# Altium project ChanginMelodies_RPIShield.PrjPcb
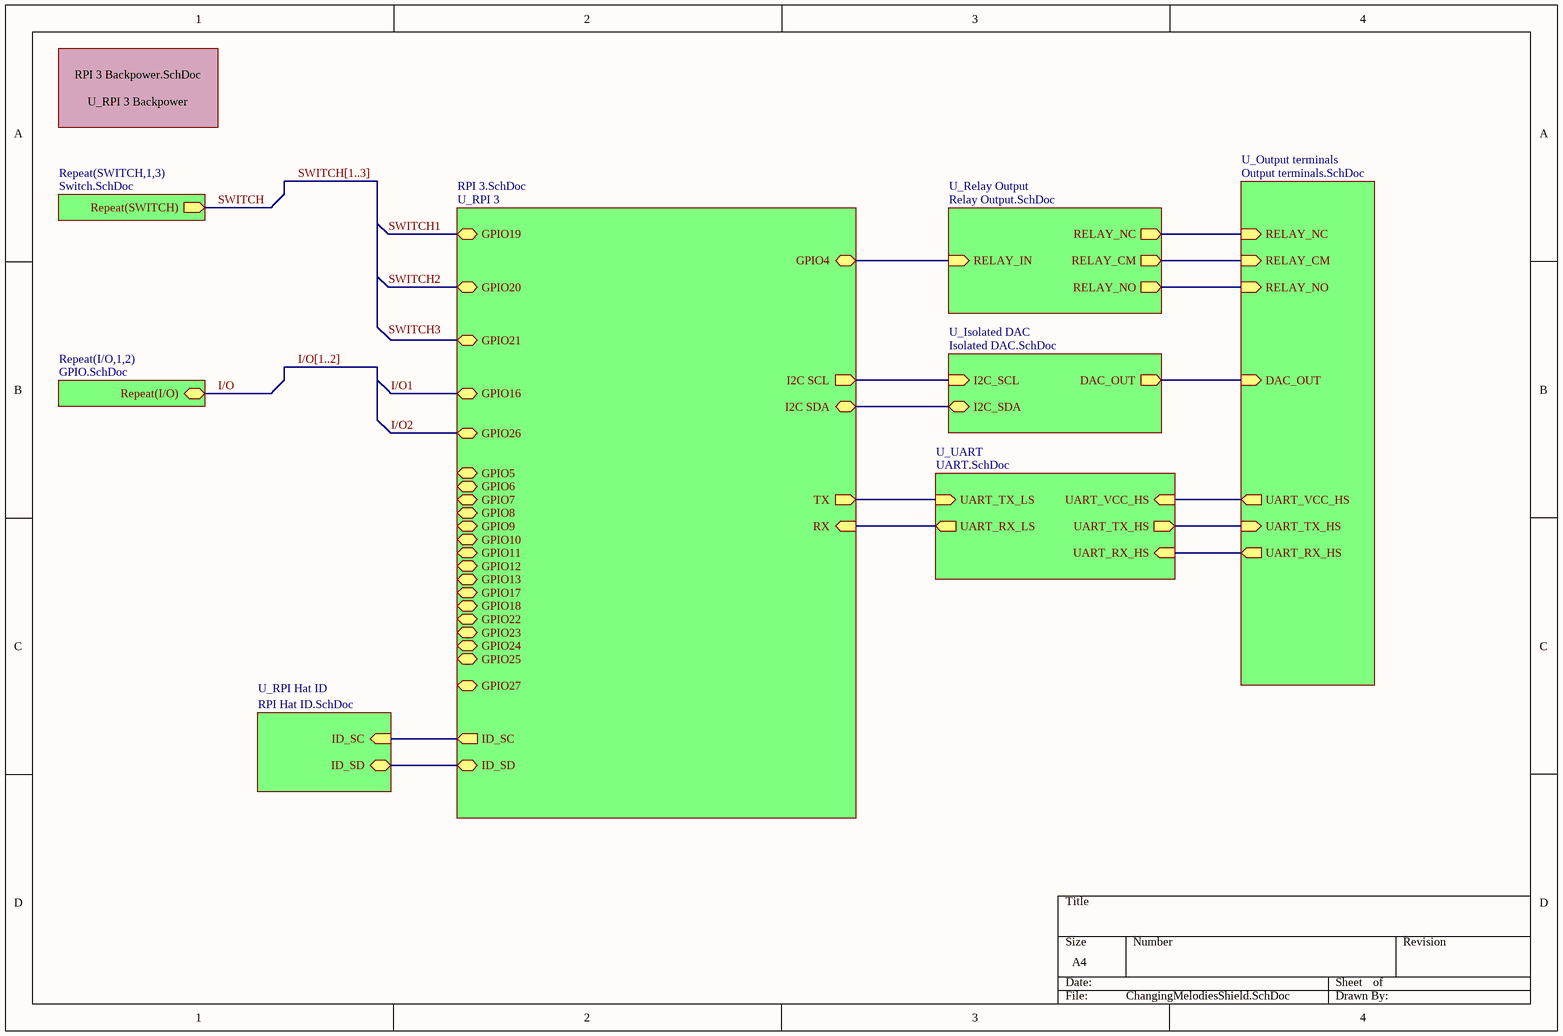
[diagram p0: ChangingMelodiesShield.SchDoc]
9 sheets, 52 parts. Net scope: hierarchical (ports join the sheet entries above them; power ports are global).
Board file: ChangingMelodiesShield.PcbDoc
Sheets:
  ChangingMelodiesShield.SchDoc
    U_RPI 3 = RPI 3.SchDoc
    U_RPI 3 Backpower = RPI 3 Backpower.SchDoc
    U_RPI Hat ID = RPI Hat ID.SchDoc
    U_Output terminals = Output terminals.SchDoc
    U_Relay Output = Relay Output.SchDoc
    U_UART = UART.SchDoc
    SWITCH1 = Switch.SchDoc
    SWITCH2 = Switch.SchDoc
    SWITCH3 = Switch.SchDoc
    I/O1 = GPIO.SchDoc
    I/O2 = GPIO.SchDoc

## Sheet ChangingMelodiesShield.SchDoc
size A4

### Sub-sheets
Repeat(I/O,1,2) = GPIO.SchDoc: Repeat(I/O) (bidir)
Repeat(SWITCH,1,3) = Switch.SchDoc: Repeat(SWITCH) (out)
U_Isolated DAC = Isolated DAC.SchDoc (file not in this document): I2C_SCL (in), I2C_SDA (bidir), DAC_OUT (out)
U_Output terminals = Output terminals.SchDoc: DAC_OUT (in), RELAY_NO (in), RELAY_NC (in), RELAY_CM (in), UART_RX_HS (out), UART_VCC_HS (out), UART_TX_HS (in)
U_Relay Output = Relay Output.SchDoc: RELAY_IN (in), RELAY_NC (out), RELAY_NO (out), RELAY_CM (out)
U_RPI 3 = RPI 3.SchDoc: I2C SDA (bidir), I2C SCL (out), GPIO4 (bidir), GPIO17 (bidir), GPIO27 (bidir), GPIO22 (bidir), GPIO26 (bidir), GPIO19 (bidir), GPIO6 (bidir), GPIO5 (bidir), RX (in), TX (out), GPIO24 (bidir), GPIO25 (bidir), GPIO12 (bidir), GPIO18 (bidir), GPIO23 (bidir), ID_SD (bidir), GPIO13 (bidir), GPIO16 (bidir), GPIO8 (bidir), ID_SC (out), GPIO21 (bidir), GPIO7 (bidir), GPIO20 (bidir), GPIO11 (bidir), GPIO9 (bidir), GPIO10 (bidir)
U_RPI 3 Backpower = RPI 3 Backpower.SchDoc: no entries
U_RPI Hat ID = RPI Hat ID.SchDoc: ID_SD (bidir), ID_SC (in)
U_UART = UART.SchDoc: UART_RX_LS (out), UART_TX_LS (in), UART_RX_HS (in), UART_TX_HS (out), UART_VCC_HS (in)

### Nets
GPIO4: sheet U_RPI 3/GPIO4, sheet U_Relay Output/RELAY_IN
I2C SCL: sheet U_RPI 3/I2C SCL, sheet U_Isolated DAC/I2C_SCL
I2C SDA: sheet U_RPI 3/I2C SDA, sheet U_Isolated DAC/I2C_SDA
I/O: sheet Repeat(I/O,1,2)/Repeat(I/O)
ID_SC: sheet U_RPI 3/ID_SC, sheet U_RPI Hat ID/ID_SC
ID_SD: sheet U_RPI 3/ID_SD, sheet U_RPI Hat ID/ID_SD
RELAY_CM: sheet U_Output terminals/RELAY_CM, sheet U_Relay Output/RELAY_CM
RELAY_NC: sheet U_Output terminals/RELAY_NC, sheet U_Relay Output/RELAY_NC
RELAY_NO: sheet U_Output terminals/RELAY_NO, sheet U_Relay Output/RELAY_NO
RX: sheet U_RPI 3/RX, sheet U_UART/UART_RX_LS
SWITCH: sheet Repeat(SWITCH,1,3)/Repeat(SWITCH)
TX: sheet U_RPI 3/TX, sheet U_UART/UART_TX_LS
UART_RX_HS: sheet U_Output terminals/UART_RX_HS, sheet U_UART/UART_RX_HS
UART_TX_HS: sheet U_Output terminals/UART_TX_HS, sheet U_UART/UART_TX_HS
UART_VCC_HS: sheet U_Output terminals/UART_VCC_HS, sheet U_UART/UART_VCC_HS
NetSWITCH_1: sheet U_Isolated DAC/DAC_OUT, sheet U_Output terminals/DAC_OUT

### Buses and harness runs
bus I/O[1..2]
bus SWITCH[1..3]

## Sheet RPI 3.SchDoc
size A4; SheetNumber: 1; SheetTotal: 1
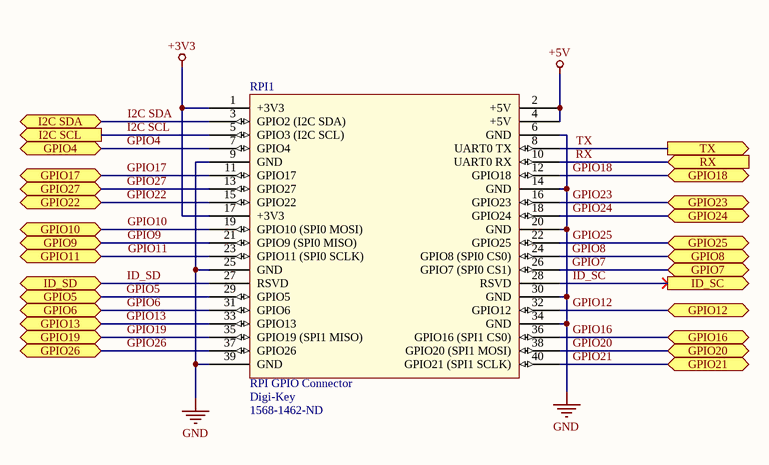
[diagram p1: RPI 3.SchDoc]

### Parts
RPI1  RPI GPIO Connector  Supplier 1: Digi-Key  Supplier Part Number 1: 1568-1462-ND  [rpi]

### Ports
GPIO4 (bidir), GPIO5 (bidir), GPIO6 (bidir), GPIO7 (bidir), GPIO8 (bidir), GPIO9 (bidir), GPIO10 (bidir), GPIO11 (bidir), GPIO12 (bidir), GPIO13 (bidir), GPIO16 (bidir), GPIO17 (bidir), GPIO18 (bidir), GPIO19 (bidir), GPIO20 (bidir), GPIO21 (bidir), GPIO22 (bidir), GPIO23 (bidir), GPIO24 (bidir), GPIO25 (bidir), GPIO26 (bidir), GPIO27 (bidir), I2C SCL (out), I2C SDA (bidir), ID_SC (out), ID_SD (bidir), RX (in), TX (out)

### Nets
+3V3: RPI1.1(+3V3) RPI1.17(+3V3)
+5V: RPI1.2(+5V) RPI1.4(+5V)
GND: RPI1.6(GND) RPI1.9(GND) RPI1.14(GND) RPI1.20(GND) RPI1.25(GND) RPI1.30(GND) RPI1.34(GND) RPI1.39(GND)
GPIO4: RPI1.7(GPIO4) ; port GPIO4
GPIO5: RPI1.29(GPIO5) ; port GPIO5
GPIO6: RPI1.31(GPIO6) ; port GPIO6
GPIO7: RPI1.26(GPIO7_(SPI0_CS1)) ; port GPIO7
GPIO8: RPI1.24(GPIO8_(SPI0_CS0)) ; port GPIO8
GPIO9: RPI1.21(GPIO9_(SPI0_MISO)) ; port GPIO9
GPIO10: RPI1.19(GPIO10_(SPI0_MOSI)) ; port GPIO10
GPIO11: RPI1.23(GPIO11_(SPI0_SCLK)) ; port GPIO11
GPIO12: RPI1.32(GPIO12) ; port GPIO12
GPIO13: RPI1.33(GPIO13) ; port GPIO13
GPIO16: RPI1.36(GPIO16_(SPI1_CS0)) ; port GPIO16
GPIO17: RPI1.11(GPIO17) ; port GPIO17
GPIO18: RPI1.12(GPIO18) ; port GPIO18
GPIO19: RPI1.35(GPIO19_(SPI1_MISO)) ; port GPIO19
GPIO20: RPI1.38(GPIO20_(SPI1_MOSI)) ; port GPIO20
GPIO21: RPI1.40(GPIO21_(SPI1_SCLK)) ; port GPIO21
GPIO22: RPI1.15(GPIO22) ; port GPIO22
GPIO23: RPI1.16(GPIO23) ; port GPIO23
GPIO24: RPI1.18(GPIO24) ; port GPIO24
GPIO25: RPI1.22(GPIO25) ; port GPIO25
GPIO26: RPI1.37(GPIO26) ; port GPIO26
GPIO27: RPI1.13(GPIO27) ; port GPIO27
I2C SCL: RPI1.5(GPIO3_(I2C_SCL)) ; port I2C SCL
I2C SDA: RPI1.3(GPIO2_(I2C_SDA)) ; port I2C SDA
ID_SC: RPI1.28(RSVD) ; port ID_SC
ID_SD: RPI1.27(RSVD) ; port ID_SD
RX: RPI1.10(UART0_RX) ; port RX
TX: RPI1.8(UART0_TX) ; port TX

### Library data of the parts
RPI1 = rpi connector: GPIO Header for Raspberry Pi A+/B+/Pi 2/Pi 3 - 2x20; Manufacturer: SparkFun Electronics; Manufacturer Part Number: PRT-14017; Nils Minor: author; nilsminor@web.de: mail; RoHS: RoHS Compliant; Category: Development Boards, Kits, Programmers; Stock 1: 150; Pricing 1: 1=1.84 (EUR); Part Status: Active; Accessory Type: Connector; For Use With/Related Products: Raspberry Pi; ComponentLink1URL: https://cdn.sparkfun.com/datasheets/Dev/RaspberryPi/12313.pdf; ComponentLink1Description: https://cdn.sparkfun.com/datasheets/Dev/RaspberryPi/12313.pdf

## Sheet RPI 3 Backpower.SchDoc
size A4
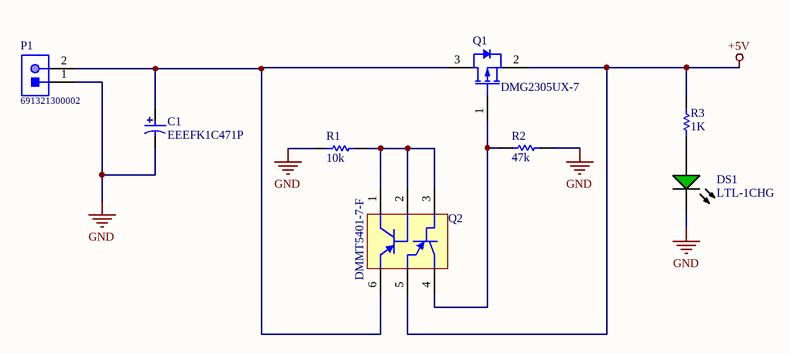
[diagram p2: RPI 3 Backpower.SchDoc]

### Parts
C1  EEEFK1C471P  [PNSC-FK-V-F_V]
DS1  LTL-1CHG  [LTST-LTL-1CHG-2]
P1  691321300002  [691321300002]
Q1  DMG2305UX-7  [DIOD-SOT23-3_A_V]
Q2  DMMT5401-7-F  [DIOD-SOT-26-6_N]
R1  10k  [RESC1609X55X30LL15T15]
R2  47k  [RESC1608X55X25LL10T15]
R3  1K  [RESC1608X55X30LL15T15]

### Nets
+5V: Q1.2(SOURCE) Q2.5(E2) R3.2
GND: C1.2 DS1.2(K) P1.1 R1.1 R2.1
NetC1_1: C1.1 P1.2 Q1.3(DRAIN) Q2.6(E1)
NetDS1_1: DS1.1(A) R3.1
NetQ1_1: Q1.1(GATE) Q2.4(C2) R2.2
NetQ2_1: Q2.1(C1) Q2.2(B1) Q2.3(B2) R1.2

### Library data of the parts
C1 = CMP-2000-06204-1: Aluminum Electrolytic Capacitor, 470 uF, +/- 20%, 16 V, 2-Pin SMD (Size Code F), -55 to 105 degC, RoHS, Tape and Reel; Manufacturer: Panasonic; Capacitance: 470µF; Type: Can; Ripple Current: 600mA; Lifetime@Temperature: 2000Hrs@105°C; Impedance: 0.16O; Rated Voltage: 16V; Manufacturer URL: http://www.panasonic.com/; Package Description: 2-Pin Electrolytic Aluminum Capacitor, Body 8.3 x 8.3 mm; Operating Temp-Max: 105°C; Mounting Technology: SurfaceMount; Operating Temp Range: -55to+105°C; Datasheet Version: 03/2016; Series: FK; Package Reference: FK-V-F; Case Size/Dimension: Ø8x10.2mm; Package URL: http://industrial.panasonic.com/cdbs/www-data/pdf/RDE0000/DME0000COL48.pdf; Datasheet URL: http://industrial.panasonic.com/cdbs/www-data/pdf/RDE0000/ABA0000C1181.pdf
DS1 = CMP-1674-00014-1: LITE-ON Electronic, INC, 120 mA, 100 mW, 5 V, -55 to 100 degC, 2-Pin THD, RoHS, Bulk; Case\Package: QFN; Max Supply Voltage: 3.6 V; Interface: I2C; Min Supply Voltage: 2.5 V; ComponentLink1URL: http://www.us.liteon.com/; DatasheetVersion: Mar-00; Max Operating Temperature: 85 degC; ComponentLink2URL: http://datasheet.octopart.com/LTL-1CHG-Lite-On-datasheet-143841.pdf; Min Operating Temperature: -40 degC; PackageReference: LTL-1CHG; RoHSCompliant: true; Pins: 24; PackageDescription: 2-Pin Through Hole Device, Dia 3.8 mm; ComponentLink1Description: Manufacturer URL; Packaging: Cut Tape; ComponentLink2Description: Datasheet; Package Quantity: 5000; REACH SVHC: No SVHC
P1 = CMP-1502-01863-1: Serie 321 - 3.81mm Vertical PCB Header WR-TBL, 2 pin; Manufacturer: Wurth Elektronik; Gender: Male; Pin Number: 2; Part Number: 691321300002; Mounting Technology: THT; Manufacturer URL: http://www.we-online.de; Datasheet URL: http://katalog.we-online.de/em/datasheet/6913213000xx.pdf; Packaging: Box; Package Reference: 691321300002; Publisher: WurthElektronik; Pitch: 3.81mm; Operating Temperature: -40to105degC
Q1 = CMP-1693-00002-3: P-Channel Enhancement Mode MOSFET, 20 V, -55 to 150 degC, 3-Pin SOT23, RoHS, Tape and Reel; RoHSCompliant: True; Pins: 3; PackageDescription: 3-Pin Small Outline Transistor, Body 2.9 x 1.3 mm, Pitch 0.915 mm; Min Operating Temperature: -55 degC; Mounting Technology: Surface Mount; ComponentLink2URL: http://www.diodes.com/_files/datasheets/DMG2305UX.pdf; PartNumber: DMG2305UX-7; ComponentLink1URL: http://www.diodes.com/; DatasheetVersion: Rev. 5-2; Max Operating Temperature: 150 degC; Packaging: Tape and Reel; Radiation Hardening: No; ComponentLink1Description: Manufacturer URL; Case/Package: TO-236-3; ComponentLink2Description: Datasheet; Package Quantity: 1; Mount: Surface Mount
Q2 = CMP-1667-00007-1: Matched PNP Small Signal Surface Mount Transistor, 300 mW, -55 to 150 degC, 6-Pin SOT-26, RoHS, Tape and Reel; Tolerance: 1%; Resistance: 56.2 kohm; Case\Package: 0603; Voltage Rating: 50 V; Power Rating: 100 mW; Width: 0.8 mm; ComponentLink2URL: http://www.diodes.com/_files/datasheets/ds30437.pdf; ComponentLink2Description: Datasheet; Min Operating Temperature: -55 degC; Max Operating Temperature: 155 degC; Height: 0.45 mm; Case Code (Metric): 1608; Package Quantity: 200; DatasheetVersion: Rev. 6-2, 05/2009; Packaging: Tape and Reel; Length: 1.6 mm; PackageDescription: 6-Pin Small Outline Transistor, Body 1.6 x 3 mm, Pitch 0.95 mm; RoHSCompliant: true; PackageReference: SOT-26-6; ComponentLink1URL: http://www.diodes.com/; Case Code (Imperial): 0603; ComponentLink1Description: Manufacturer URL
R1 = CMP-2000-07452-1: Chip Resistor, 10 KOhm, +/- 1%, 0.1 W, -55 to 155 degC, 0603 (1608 Metric), RoHS, Tape and Reel; Manufacturer: Panasonic; Voltage Rating: 75V; Case\/Package: 0603; Power Rating: 100mW; Resistance: 10KOhm; Temperature Coefficient: 100ppm\/degreesC; Number of Pins: 2; Package Reference: 603; Depth: 0.8mm; Mount: SurfaceMount; Package Description: 2-Pin Surface Mount Device, Body 1.6 x 0.85 mm; Datasheet Version: 02/2017; Length: 1.6mm; Lead Free: LeadFree; Height: 0.45mm; Number of Terminations: 2; Max Power Dissipation: 100mW; Min Operating Temperature: -55degC; Datasheet URL: https://industrial.panasonic.com/cdbs/www-data/pdf/RDA0000/AOA0000C304.pdf; Termination: SMD/SMT; Case Code (Metric): 1608; Case Code (Imperial): 0603; Tolerance: 1%; Max Operating Temperature: 155degC; RoHSCompliant: true; Voltage Rating (DC): 75V; Radiation Hardening: No; Packaging: TapeandReel; Composition: ThickFilm; Mounting Technology: SurfaceMount; Manufacturer URL: http://www.panasonic.com/; Width: 0.031inch; REACH SVHC: NoSVHC; Contact Plating: Tin; Military Standard: Not; Package Quantity: 1
R2 = CMP-2000-04844-1: Manufacturer: Yageo; Part Number: AC0603FR-0747KL
R3 = CMP-2000-00180-1: Part Number: ERJ-3EKF1001V; Manufacturer: Panasonic

## Sheet RPI Hat ID.SchDoc
size A4
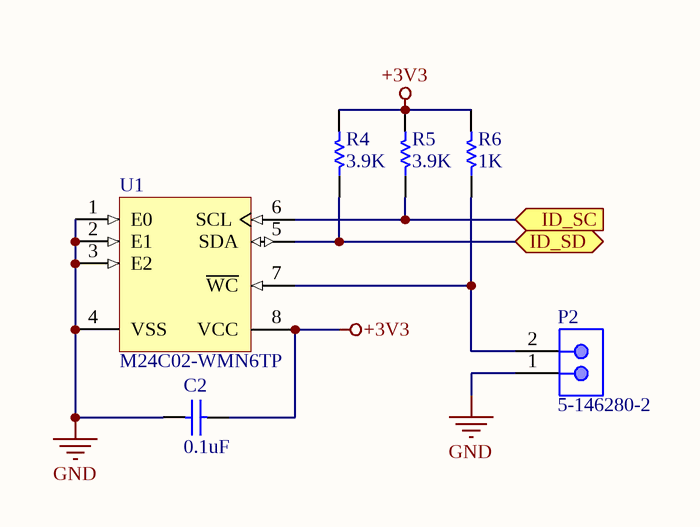
[diagram p3: RPI Hat ID.SchDoc]

### Parts
C2  0.1uF  [CAPC1608X87X35NL15T15]
P2  5-146280-2  [TECO-5-146280-2_V]
R4  3.9K  [RESC1608X55X30ML15T15]
R5  3.9K  [RESC1608X55X30ML15T15]
R6  1K  [RESC1608X55X30ML15T15]
U1  M24C02-WMN6TP  [STM-M24C02-WMN6TP-8_M]

### Ports
ID_SC (in), ID_SD (bidir)

### Nets
+3V3: C2.1 R4.2 R5.2 R6.2 U1.8(VCC)
GND: C2.2 P2.1 U1.1(E0) U1.2(E1) U1.3(E2) U1.4(VSS)
ID_SC: R5.1 U1.6(SCL) ; port ID_SC
ID_SD: R4.1 U1.5(SDA) ; port ID_SD
NetP2_2: P2.2 R6.1 U1.7(~{WC})

### Library data of the parts
C2 = CMP-2006-03300-1: Part Number: C0603X104K5RACTU; Manufacturer: Kemet
P2 = CMP-2000-07492-1: Male Header, Pitch 2.54 mm, 1 x 2 Position, Height 8.21 mm, Tail Length 3.05 mm, -65 to 105 degC, RoHS, Bulk; Manufacturer: TE Connectivity; Mating Connector Lock: No(Without); Number of Positions: 2; Pitch: 2.54mm; PCB Mounting Orientation: Vertical; Keyed: No; Case\/Package: 100; Mating Post Length: 0.23inch; High Temperature Housing: Yes; Max Current Rating: 5A; PCB Thickness: 0.063inch; PCB Mount Retention: Without; Approvals: CSA; Current Rating: 3A; Radiation Hardening: No; Length: 4.67mm; Contact Mating Length: 0.23inch; Connector Type: Header; Number of Rows: 1; Termination Post Length: 0.12inch; Board Standoff: No(Without); Max Operating Temperature: 105degC; Contact Shape: Square; Selectively Loaded: No(Without); Gasket: No(Without); Number of Contacts: 2; Contact Gender: Male; Mating Alignment: No(Without); Manufacturer URL: http://www.te.com/; Datasheet URL: http://www.te.com/commerce/DocumentDelivery/DDEController?Action=showdoc&DocId=Customer+Drawing%7F146280%7FH1%7Fpdf%7FEnglish%7FENG_CD_146280_H1.pdf%7F5-146280-2; Mount: ThroughHole; Orientation: Straight; Packaging: Carton; Package Reference: 5-146280-2; Package Quantity: 500; Stabilizers: No(Without); Row Spacing: 2.54mm; Contact Material: CopperAlloy; Panel Mount Retention: No(Without); Datasheet Version: Rev. H1, 08/2016; Housing Colour: Black; Colour: Black; Package Description: Male Header, Pitch 2.54 mm, 1 x 2 Position, Height 8.21 mm, Tail Length 3.05 mm; Contact Plating: Matte; Housing Material: Polymer; Contact Protection: No(Without); Min Operating Temperature: -65degC; Mounting Technology: ThroughHole; Flammability Rating: UL94V-0; RoHSCompliant: true; Termination: ThroughHole; Depth: 2.34mm; High Speed Serial Data Connector: No
R4-R6 = CMP-2000-00180-1: as R3 on sheet RPI 3 Backpower
U1 = CMP-2000-05370-1: EEPROM Serial-I2C, 2Kbit, 2.5 to 5.5 V, 400 kHz, 8-Pin SO, -40 to 85 degC, RoHS, Tape and Reel; Manufacturer: STMicroelectronics; Supply Current: 2mA; Frequency: 0.4MHz; Data Retention: 40; Density: 2048Bit; Rad Hardened: No; Write Protection: Yes; Interface Type: Serial(I2C); DELETED: Compliant; Access Time (Max): 900ns; Operating Supply Voltage (Typ): 3.3/5V; Operating Supply Voltage (Max): 5.5V; Organization: 256x8; Operating Supply Voltage (Min): 2.5V; Operating Temperature (Max): 85C; Operating Temperature Classification: Industrial; Operating Temp Range: -40Cto85C; Frequency (Max): 0.4MHz; Datasheet URL: https://datasheet.ciiva.com/26870/m24c02-wmn6tp-26870257.pdf; Package Type: SOICN; Operating Temperature (Min): -40C; Programmable: Yes; Manufacturer URL: http://www.st.com/; Pin Count: 8; Packaging: TapeandReel; Mounting: SurfaceMount; Datasheet Version: Rev. 17, 04/2011

## Sheet Output terminals.SchDoc
size A4
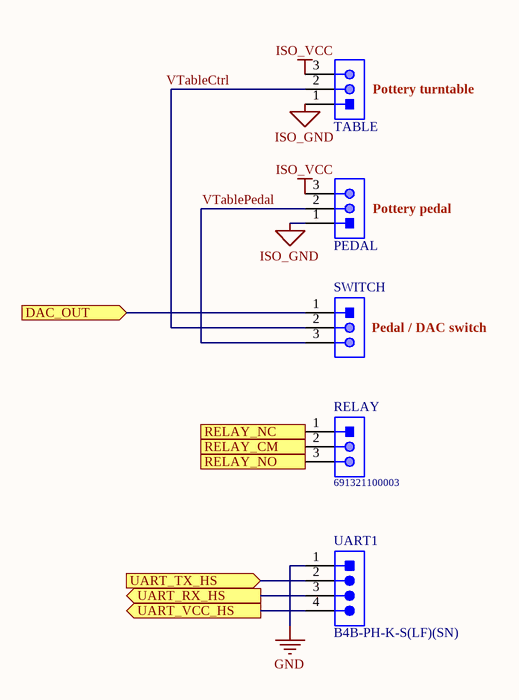
[diagram p4: Output terminals.SchDoc]

### Parts
PEDAL  691321300003  [691321300003]  (value not drawn)
RELAY  691321100003  [691321100003]
SWITCH  691321300003  [691321300003]  (value not drawn)
TABLE  691321300003  [691321300003]  (value not drawn)
UART1  B4B-PH-K-S(LF)(SN)  [JST-B4B-PH-K-S_V]

### Ports
DAC_OUT (in), RELAY_CM (in), RELAY_NC (in), RELAY_NO (in), UART_RX_HS (out), UART_TX_HS (in), UART_VCC_HS (out)

### Nets
GND: UART1.1
ISO_GND: PEDAL.1 TABLE.1
ISO_VCC: PEDAL.3 TABLE.3
RELAY_CM: RELAY.2 ; port RELAY_CM
RELAY_NC: RELAY.1 ; port RELAY_NC
RELAY_NO: RELAY.3 ; port RELAY_NO
UART_RX_HS: UART1.3 ; port UART_RX_HS
UART_TX_HS: UART1.2 ; port UART_TX_HS
UART_VCC_HS: UART1.4 ; port UART_VCC_HS
VTableCtrl: SWITCH.2 TABLE.2
VTablePedal: PEDAL.2 SWITCH.3
NetSWITCH_1: SWITCH.1 ; port DAC_OUT

### Notes on the sheet
- (near TABLE) Pottery turntable
- (near PEDAL) Pottery pedal
- (near SWITCH) Pedal / DAC switch

### Library data of the parts
PEDAL SWITCH TABLE = CMP-1502-01864-1: Serie 321 - 3.81mm Vertical PCB Header WR-TBL, 3 pin; Manufacturer: Wurth Elektronik; Pin Number: 3; Gender: Male; Datasheet URL: http://katalog.we-online.de/em/datasheet/6913213000xx.pdf; Package Reference: 691321300003; Pitch: 3.81mm; Publisher: WurthElektronik; Part Number: 691321300003; Mounting Technology: THT; Packaging: Box; Manufacturer URL: http://www.we-online.de; Operating Temperature: -40to105degC
RELAY = CMP-1502-01784-1: Serie 3211 - 3.50mm Vertical PCB Header WR-TBL, 3 pin; Manufacturer: Wurth Elektronik; Pin Number: 3; Gender: Male; Datasheet URL: http://katalog.we-online.de/em/datasheet/6913211000xx.pdf; Package Reference: 691321100003; Pitch: 3.50mm; Publisher: WurthElektronik; Part Number: 691321100003; Mounting Technology: THT; Packaging: Box; Manufacturer URL: http://www.we-online.de; Operating Temperature: -40to105degC
UART1 = CMP-2000-05165-1: Male Header, Pitch 2 mm, 1 x 4 Position, Height 6 mm, Tail Length 3.4 mm, -25 to 85 degC, RoHS, Bulk; Manufacturer: JST; No of Positions: 4; Style/Orientation: StraightHeader/Plug; Pitch: 2mm; Datasheet URL: http://datasheet.octopart.com/B4B-PH-K-S%28LF%29%28SN%29-JST-datasheet-10558886.pdf; Type: ShroudedHeader; Manufacturer URL: http://www.jst.com/home2.html; Termination: Crimp; Datasheet Version: Apr-09

## Sheet Relay Output.SchDoc
size A4
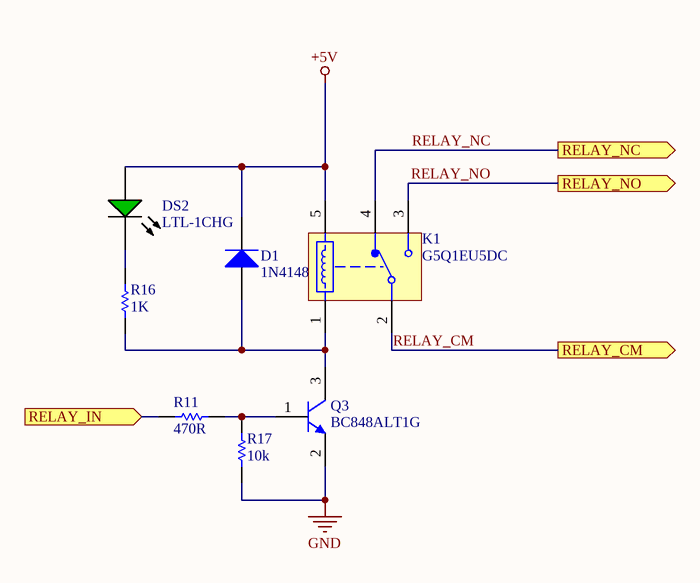
[diagram p5: Relay Output.SchDoc]

### Parts
D1  1N4148WT  [FAIR-SOD-523F-2_V]
DS2  LTL-1CHG  [LTST-LTL-1CHG-2]
K1  G5Q1EU5DC  [G5Q1EU5DC]
Q3  BC848ALT1G  [ONSC-SOT-23-3-318-08_V]
R11  470R  [RESC0603(1608)_M]
R16  1K  [RESC1608X55X30LL15T15]
R17  10k  [RESC1609X55X30LL15T15]

### Ports
RELAY_CM (out), RELAY_IN (in), RELAY_NC (out), RELAY_NO (out)

### Nets
+5V: D1.1(K) DS2.1(A) K1.5
GND: Q3.2(E) R17.1
GPIO4: R11.1 ; port RELAY_IN
RELAY_CM: K1.2 ; port RELAY_CM
RELAY_NC: K1.4 ; port RELAY_NC
RELAY_NO: K1.3 ; port RELAY_NO
NetD1_2: D1.2(A) K1.1 Q3.3(C) R16.1
NetDS2_2: DS2.2(K) R16.2
NetQ3_1: Q3.1(B) R11.2 R17.2

### Library data of the parts
D1 = CMP-0881-00001-1: High Conductance Fast Switching Diode, 75 V, -55 to 150 degC, 2-Pin SOD523F, RoHS; Manufacturer: Fairchild Semiconductor; IR (VR: 75 V)=5 uA Max.; VF: 1 V Max.; BVR (IR: 5 uA)=75 V Min.; CO: 4 pF Max.; DatasheetVersion: Rev. A2; ComponentLink1Description: Manufacturer URL; PackageDescription: 2-Pin Surface Mount Device, Body 1.2 x 0.8 mm, Height 0.7 mm; ComponentLink2URL: http://www.fairchildsemi.com/ds/1N/1N4148WT.pdf; ComponentLink2Description: Datasheet; PartNumber: 1N4148WT; ComponentLink1URL: http://www.fairchildsemi.com/; Temperature Range: -55 to 150 degC; Mounting Technology: Surface Mount; PackageReference: SOD-523F-2; RoHS: TRUE
DS2 = CMP-1674-00014-1: as DS1 on sheet RPI 3 Backpower; ComponentLink1URL: http://www.us.liteon.com/; DatasheetVersion: Mar-00; Max Operating Temperature: 85 degC; ComponentLink2URL: http://datasheet.octopart.com/LTL-1CHG-Lite-On-datasheet-143841.pdf; Min Operating Temperature: -40 degC; PackageReference: LTL-1CHG; RoHSCompliant: true; Pins: 24; PackageDescription: 2-Pin Through Hole Device, Dia 3.8 mm; ComponentLink1Description: Manufacturer URL; Packaging: Cut Tape; ComponentLink2Description: Datasheet; Package Quantity: 5000; REACH SVHC: No SVHC
K1 = G5Q1EU5DC: OMRON - G5Q-1EU 5DC - RELAY, SPDT, 250VAC, 30VDC, 10A; Coil Resistance: 63R; Coil Voltage (DC): 5V; Coil Type: Non-Latching; Coil Current: 80mA; Voltage Rating (AC): 277V; Operate Time: 10ms; Switching Capacity: 1.25kW; Ratings: IP67; Supplier 1: Distrelec; Manufacturer 1: Omron; Manufacturer Part Number 1: G5Q1EU5DC; Stock 1: 8265; Pricing 1: 10=1,55000, 50=1,31000 (EUR); RoHS: Yes; Mount: PCB; Number of Pins: 5; Contact Material: Silver; Min Operating Temperature: -40°C; Max Operating Temperature: 85°C; Contact Current Rating: 10A; Termination: PC Pin; Throw Configuration: SPDT; Switching Current: 10A; Length: 20.3mm; Height: 15.8mm; Depth: 10.3mm; Width: 10.3mm; REACH SVHC: Unknown; ComponentLink1URL: https://datasheet.ciiva.com/29336/503930-da-01-en-kompaktes-pcb-powerrelais-g5q-1-eu-5dc-29336254.pdf?src-supplier=Conrad; ComponentLink1Description: https://datasheet.ciiva.com/29336/503930-da-01-en-kompaktes-pcb-powerrelais-g5q-1-eu-5dc-29336254.pdf?src-supplier=Conrad; ComponentLink2URL: https://datasheet.ciiva.com/26311/g5q-eng-26311244.pdf?src-supplier=Distrelec; ComponentLink2Description: https://datasheet.ciiva.com/26311/g5q-eng-26311244.pdf?src-supplier=Distrelec; Supplier Part Number 1: 11072346
Q3 = CMP-1048-00699-1: General Purpose Transistor, NPN Silicon, 3-Pin SOT-23, Pb-Free, Tape and Reel; Manufacturer: On Semiconductor; fT Min (MHz): 100; IC Continuous (A): 0.1; PackageDescription: 3-Pin Small Outline Transistor, Body 2.92 x 1.3 mm, Pitch 0.95 mm; DatasheetVersion: Rev. 11; ComponentLink2URL: http://www.onsemi.cn/pub_link/Collateral/BC846ALT1-D.PDF; ComponentLink3Description: Package Specification; Packing: Tape and Reel; ComponentLink3URL: http://www.onsemi.cn/pub_link/Collateral/318-08.PDF; ComponentLink1Description: Manufacturer URL; ComponentLink1URL: http://www.onsemi.com/; PackageVersion: Rev. AP, 11/2009; PartNumber: BC848ALT1G; PackageReference: SOT-23-3-318-08; Polarity: NPN; RoHS: TRUE; ComponentLink2Description: Datasheet; Mounting Technology: Surface Mount
R11 = CMP-1012-00473-1: 470R 0.1W 1% 0603 (1608 Metric)  SMD; Value: 470.00 Ohm; Case-Metric: 1608; Case-EIA: 0603; Power: 0.1 W; Technology: SMT; Tolerance: 1 %
R16 = CMP-2000-00180-1: as R3 on sheet RPI 3 Backpower
R17 = CMP-2000-07452-1: as R1 on sheet RPI 3 Backpower; Number of Pins: 2; Package Reference: 603; Depth: 0.8mm; Mount: SurfaceMount; Package Description: 2-Pin Surface Mount Device, Body 1.6 x 0.85 mm; Datasheet Version: 02/2017; Length: 1.6mm; Lead Free: LeadFree; Height: 0.45mm; Number of Terminations: 2; Max Power Dissipation: 100mW; Min Operating Temperature: -55degC; Datasheet URL: https://industrial.panasonic.com/cdbs/www-data/pdf/RDA0000/AOA0000C304.pdf; Termination: SMD/SMT; Case Code (Metric): 1608; Case Code (Imperial): 0603; Tolerance: 1%; Max Operating Temperature: 155degC; RoHSCompliant: true; Voltage Rating (DC): 75V; Radiation Hardening: No; Packaging: TapeandReel; Composition: ThickFilm; Mounting Technology: SurfaceMount; Manufacturer URL: http://www.panasonic.com/; Width: 0.031inch; REACH SVHC: NoSVHC; Contact Plating: Tin; Military Standard: Not; Package Quantity: 1

## Sheet UART.SchDoc
size A4
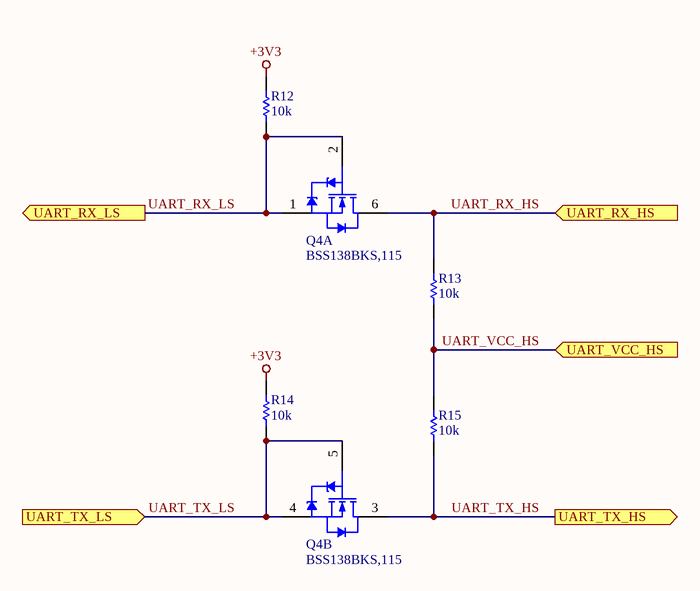
[diagram p6: UART.SchDoc]

### Parts
Q4  BSS138BKS,115  [NXP-SOT363_L]  (parts A,B of 2)
R12  10k  [RESC1609X55X30LL15T15]
R13  10k  [RESC1609X55X30LL15T15]
R14  10k  [RESC1609X55X30LL15T15]
R15  10k  [RESC1609X55X30LL15T15]

### Ports
UART_RX_HS (in), UART_RX_LS (out), UART_TX_HS (out), UART_TX_LS (in), UART_VCC_HS (in)

### Nets
+3V3: R12.2 R14.2
UART_RX_HS: Q4.6(D1) R13.2 ; port UART_RX_HS
UART_RX_LS: Q4.1(S1) Q4.2(G1) R12.1 ; port UART_RX_LS  [project net RX]
UART_TX_HS: Q4.3(D2) R15.1 ; port UART_TX_HS
UART_TX_LS: Q4.4(S2) Q4.5(G2) R14.1 ; port UART_TX_LS  [project net TX]
UART_VCC_HS: R13.1 R15.2 ; port UART_VCC_HS

### Library data of the parts
Q4 = CMP-1259-00117-1: Dual N-Channel Trench MOSFET, 60 V, 0.32 A, -55 to 150 degC, 6-Pin SOT363, Tape and Reel; Manufacturer: NXP Semiconductors; IDM [max] (A): 1.2; Automotive Qualified: Y; Channel Type: N; Packing: Tape & Reel; ID [max] (A): 0.32; VGSth [typ] (V): 1.1; VDS [max] (V): 60; ComponentLink2Description: Datasheet; Mounting Technology: Surface Mount; ComponentLink2URL: http://www.nxp.com/documents/data_sheet/BSS138BKS.pdf; ComponentLink3Description: Package Specification; Code_JEITA: SC-88; PartNumber: BSS138BKS,115; PackageVersion: 06-03-16, 03/2006; ComponentLink1Description: Manufacturer URL; ComponentLink1URL: http://www.nxp.com/; PackageDescription: 6-Pin Small Outline Transistor Package, Body 2 x 1.25 mm, Pitch 0.65 mm; PackageReference: SOT363; ComponentLink3URL: http://www.nxp.com/documents/outline_drawing/sot363_po.pdf; DatasheetVersion: Rev. 1
R12-R15 = CMP-2000-07452-1: as R1 on sheet RPI 3 Backpower; Number of Pins: 2; Package Reference: 603; Depth: 0.8mm; Mount: SurfaceMount; Package Description: 2-Pin Surface Mount Device, Body 1.6 x 0.85 mm; Datasheet Version: 02/2017; Length: 1.6mm; Lead Free: LeadFree; Height: 0.45mm; Number of Terminations: 2; Max Power Dissipation: 100mW; Min Operating Temperature: -55degC; Datasheet URL: https://industrial.panasonic.com/cdbs/www-data/pdf/RDA0000/AOA0000C304.pdf; Termination: SMD/SMT; Case Code (Metric): 1608; Case Code (Imperial): 0603; Tolerance: 1%; Max Operating Temperature: 155degC; RoHSCompliant: true; Voltage Rating (DC): 75V; Radiation Hardening: No; Packaging: TapeandReel; Composition: ThickFilm; Mounting Technology: SurfaceMount; Manufacturer URL: http://www.panasonic.com/; Width: 0.031inch; REACH SVHC: NoSVHC; Contact Plating: Tin; Military Standard: Not; Package Quantity: 1

## Sheet Switch.SchDoc
size A4
Used 3 times, as channels SWITCH1, SWITCH2, SWITCH3. Parts and nets are listed once, with the designators drawn on the sheet.
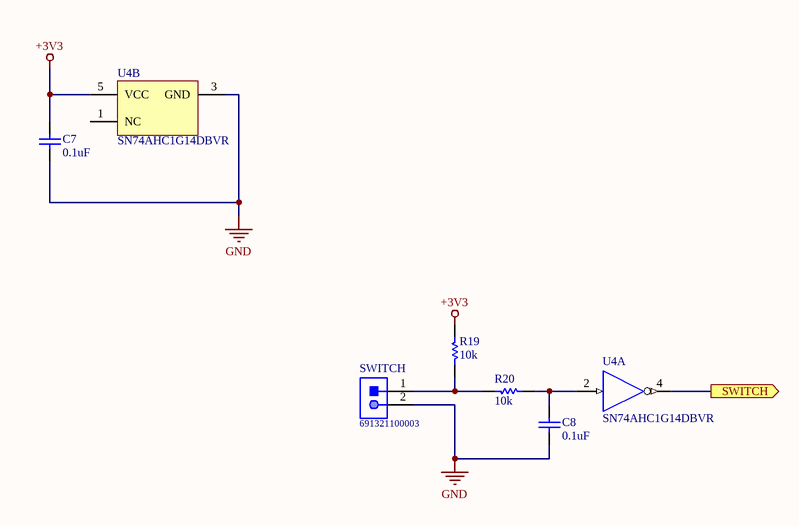
[diagram p7: Switch.SchDoc]

### Parts
C7  0.1uF  [CAPC1608X87X35NL15T15]
C8  0.1uF  [CAPC1608X87X35NL15T15]
R19  10k  [RESC1609X55X30LL15T15]
R20  10k  [RESC1609X55X30LL15T15]
SWITCH  691321100003  [691321100002]
U4  SN74AHC1G14DBVR  [DBV0005A_L]  (parts A,B of 2)

### Ports
SWITCH (out)

### Nets
+3V3: C7.1 R19.2 U4.5(VCC)
GND: C7.2 C8.2 SWITCH.2 U4.3(GND)
SWITCH: U4.4(Y) ; port SWITCH
NetC8_1: C8.1 R20.1 U4.2(A)
NetR19_1: R19.1 R20.2 SWITCH.1

Not connected (* = marked no-connect by the designer): U4 1(NC)

### Channels
SWITCH1: designators end in _SWITCH1; ports SWITCH=GPIO19
SWITCH2: designators end in _SWITCH2; ports SWITCH=GPIO20
SWITCH3: designators end in _SWITCH3; ports SWITCH=GPIO21

### Library data of the parts
C7 C8 = CMP-2006-03300-1: as C2 on sheet RPI Hat ID
R19 R20 = CMP-2000-07452-1: as R1 on sheet RPI 3 Backpower; Number of Pins: 2; Package Reference: 603; Depth: 0.8mm; Mount: SurfaceMount; Package Description: 2-Pin Surface Mount Device, Body 1.6 x 0.85 mm; Datasheet Version: 02/2017; Length: 1.6mm; Lead Free: LeadFree; Height: 0.45mm; Number of Terminations: 2; Max Power Dissipation: 100mW; Min Operating Temperature: -55degC; Datasheet URL: https://industrial.panasonic.com/cdbs/www-data/pdf/RDA0000/AOA0000C304.pdf; Termination: SMD/SMT; Case Code (Metric): 1608; Case Code (Imperial): 0603; Tolerance: 1%; Max Operating Temperature: 155degC; RoHSCompliant: true; Voltage Rating (DC): 75V; Radiation Hardening: No; Packaging: TapeandReel; Composition: ThickFilm; Mounting Technology: SurfaceMount; Manufacturer URL: http://www.panasonic.com/; Width: 0.031inch; REACH SVHC: NoSVHC; Contact Plating: Tin; Military Standard: Not; Package Quantity: 1
SWITCH = CMP-1502-01783-1: Serie 3211 - 3.50mm Vertical PCB Header WR-TBL, 2 pin; Manufacturer: Wurth Elektronik; Gender: Male; Pin Number: 2; Part Number: 691321100002; Mounting Technology: THT; Manufacturer URL: http://www.we-online.de; Datasheet URL: http://katalog.we-online.de/em/datasheet/6913211000xx.pdf; Packaging: Box; Package Reference: 691321100002; Publisher: WurthElektronik; Pitch: 3.50mm; Operating Temperature: -40to105degC
U4 = CMP-2000-07131-1: Single Schmitt-Trigger Inverter Gate, 10.6 ns max, 2 to 5.5 V, -40 to 125 degC, 5-Pin SOT23 (DBV), Green (RoHS & no Sb/Br), Tape and Reel; Manufacturer: Texas Instruments; Supply Voltage Min: 2V; Logic IC Function: SingleInverterwithSchmittTrigger; No. of Pins: 5; Logic IC Family: AHC; Output Current: 8mA; Supply Voltage: 5.5V; Logic Function Number: 741G14; SVHC: NoSVHC(19-Dec-2012); No. of Gates: 1; Base Number: 74; Supply Voltage Range: 2Vto5.5V; Logic IC Base Number: 74114; Logic Case Style: SOT-23; Datasheet Version: Rev. Q, 09/2015; Mounting Technology: SurfaceMount; Termination Type: SMD; Operating Temperature Max: 85°C; IC Generic Number: 74AHC1G14; Operating Temperature Min: -40°C; No. of Inputs: 1; Supply Voltage Max: 5.5V; Datasheet URL: http://www.ti.com/lit/ds/symlink/sn74ahc1g14.pdf; Package Description: 5-Pin Small Outline Transistor, Body 2.9 x 1.6 mm, Pitch 0.95 mm; Operating Temperature Range: -40°Cto+85°C; Output Current Max: 8mA; Package URL: http://www.ti.com/lit/ml/mpds018l/mpds018l.pdf; Package Reference: DBV0005A; Logic Type: Inverter; Manufacturer URL: http://www.ti.com/; Package / Case: SOT-23

## Sheet GPIO.SchDoc
size A4
Used 2 times, as channels I/O1, I/O2. Parts and nets are listed once, with the designators drawn on the sheet.
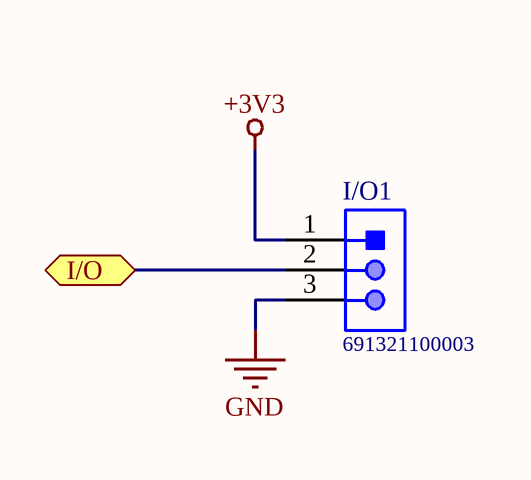
[diagram p8: GPIO.SchDoc]

### Parts
I/O1  691321100003  [691321100003]

### Ports
I/O (bidir)

### Nets
+3V3: I/O1.1
GND: I/O1.3
I/O: I/O1.2 ; port I/O

### Channels
I/O1: designators end in _I/O1; ports I/O=GPIO16
I/O2: designators end in _I/O2; ports I/O=GPIO26

### Library data of the parts
I/O1 = CMP-1502-01784-1: as RELAY on sheet Output terminals; Datasheet URL: http://katalog.we-online.de/em/datasheet/6913211000xx.pdf; Package Reference: 691321100003; Pitch: 3.50mm; Publisher: WurthElektronik; Part Number: 691321100003; Mounting Technology: THT; Packaging: Box; Manufacturer URL: http://www.we-online.de; Operating Temperature: -40to105degC

## Nets that join several sheets
+3V3: RPI 3 (RPI1.1 RPI1.17), RPI Hat ID (5 pins), UART (R12.2 R14.2), SWITCH1 (C7_SWITCH1.1 R19_SWITCH1.2 U4_SWITCH1.5), SWITCH2 (C7_SWITCH2.1 R19_SWITCH2.2 U4_SWITCH2.5), SWITCH3 (C7_SWITCH3.1 R19_SWITCH3.2 U4_SWITCH3.5), I/O1 (I/O1_I/O1.1), I/O2 (I/O1_I/O2.1)
+5V: RPI 3 (RPI1.2 RPI1.4), RPI 3 Backpower (Q1.2 Q2.5 R3.2), Relay Output (D1.1 DS2.1 K1.5)
GND: RPI 3 (8 pins), RPI 3 Backpower (5 pins), RPI Hat ID (6 pins), Output terminals (UART1.1), Relay Output (Q3.2 R17.1), SWITCH1 (C7_SWITCH1.2 C8_SWITCH1.2 SWITCH_SWITCH1.2 U4_SWITCH1.3), SWITCH2 (C7_SWITCH2.2 C8_SWITCH2.2 SWITCH_SWITCH2.2 U4_SWITCH2.3), SWITCH3 (C7_SWITCH3.2 C8_SWITCH3.2 SWITCH_SWITCH3.2 U4_SWITCH3.3), I/O1 (I/O1_I/O1.3), I/O2 (I/O1_I/O2.3)
GPIO4: RPI 3 (RPI1.7), Relay Output (R11.1)
GPIO16: RPI 3 (RPI1.36), I/O1 (I/O1_I/O1.2)
GPIO19: RPI 3 (RPI1.35), SWITCH1 (U4_SWITCH1.4)
GPIO20: RPI 3 (RPI1.38), SWITCH2 (U4_SWITCH2.4)
GPIO21: RPI 3 (RPI1.40), SWITCH3 (U4_SWITCH3.4)
GPIO26: RPI 3 (RPI1.37), I/O2 (I/O1_I/O2.2)
ID_SC: RPI 3 (RPI1.28), RPI Hat ID (R5.1 U1.6)
ID_SD: RPI 3 (RPI1.27), RPI Hat ID (R4.1 U1.5)
RELAY_CM: Output terminals (RELAY.2), Relay Output (K1.2)
RELAY_NC: Output terminals (RELAY.1), Relay Output (K1.4)
RELAY_NO: Output terminals (RELAY.3), Relay Output (K1.3)
RX: RPI 3 (RPI1.10), UART (Q4.1 Q4.2 R12.1)
TX: RPI 3 (RPI1.8), UART (Q4.4 Q4.5 R14.1)
UART_RX_HS: Output terminals (UART1.3), UART (Q4.6 R13.2)
UART_TX_HS: Output terminals (UART1.2), UART (Q4.3 R15.1)
UART_VCC_HS: Output terminals (UART1.4), UART (R13.1 R15.2)